# EAGLE schematic ECU (1) (EAGLE 6.5.0)

## Sheet 1 of 3
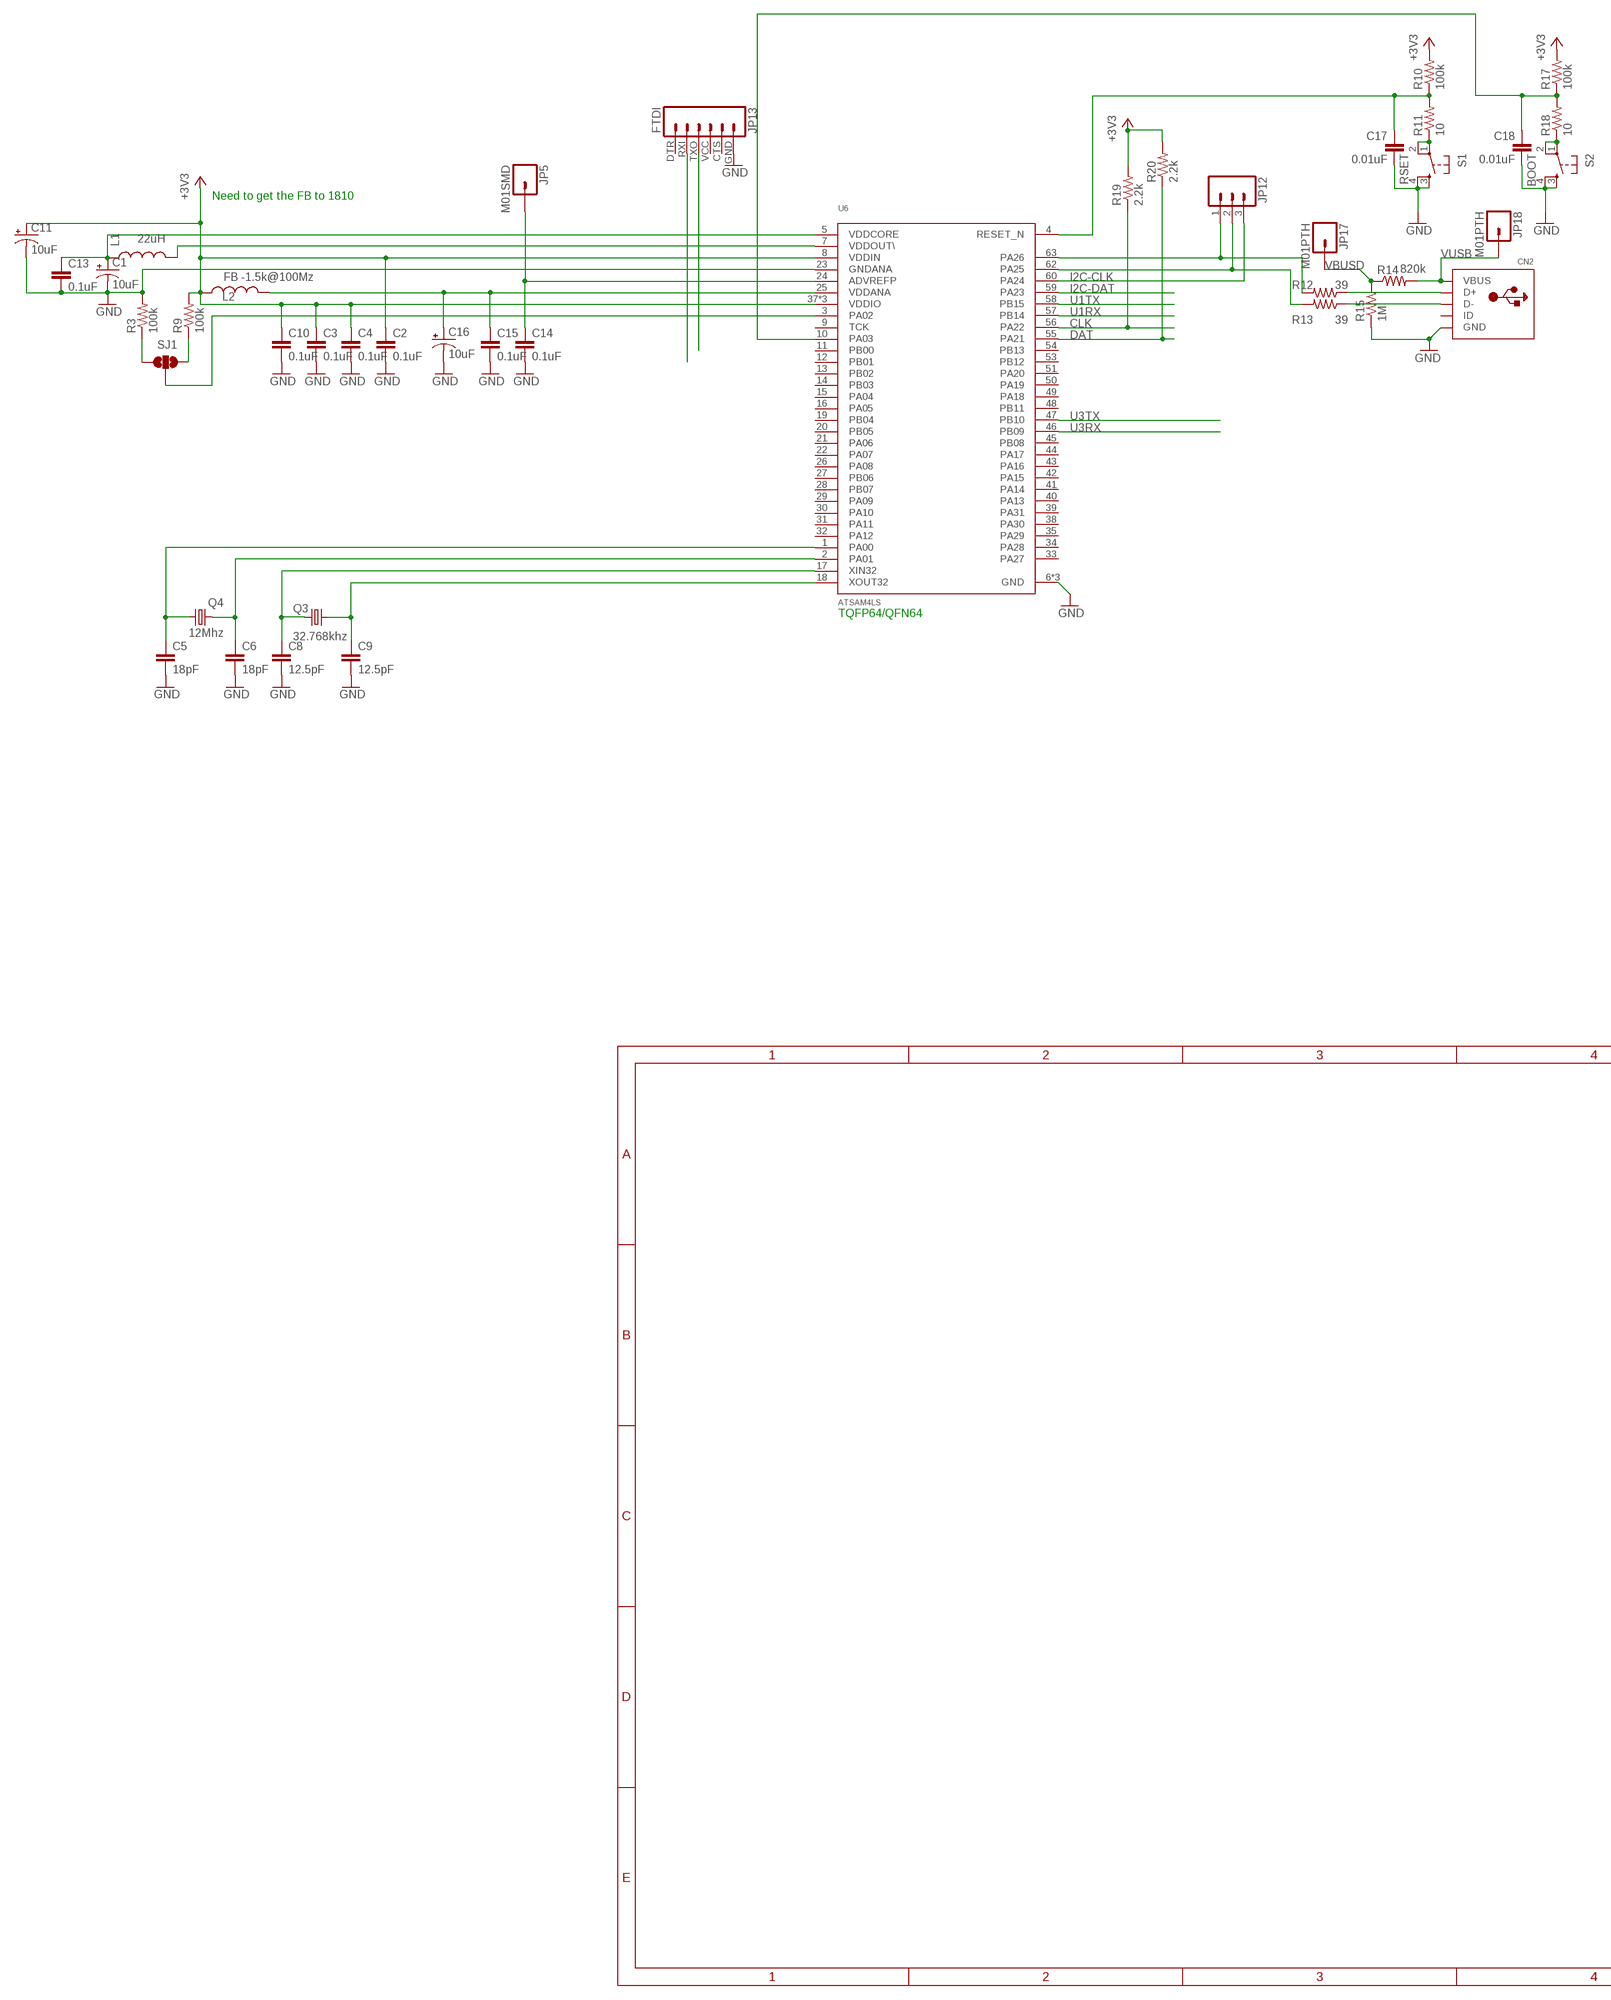
[diagram p0: schematic, sheet 1, part 1 of 2]
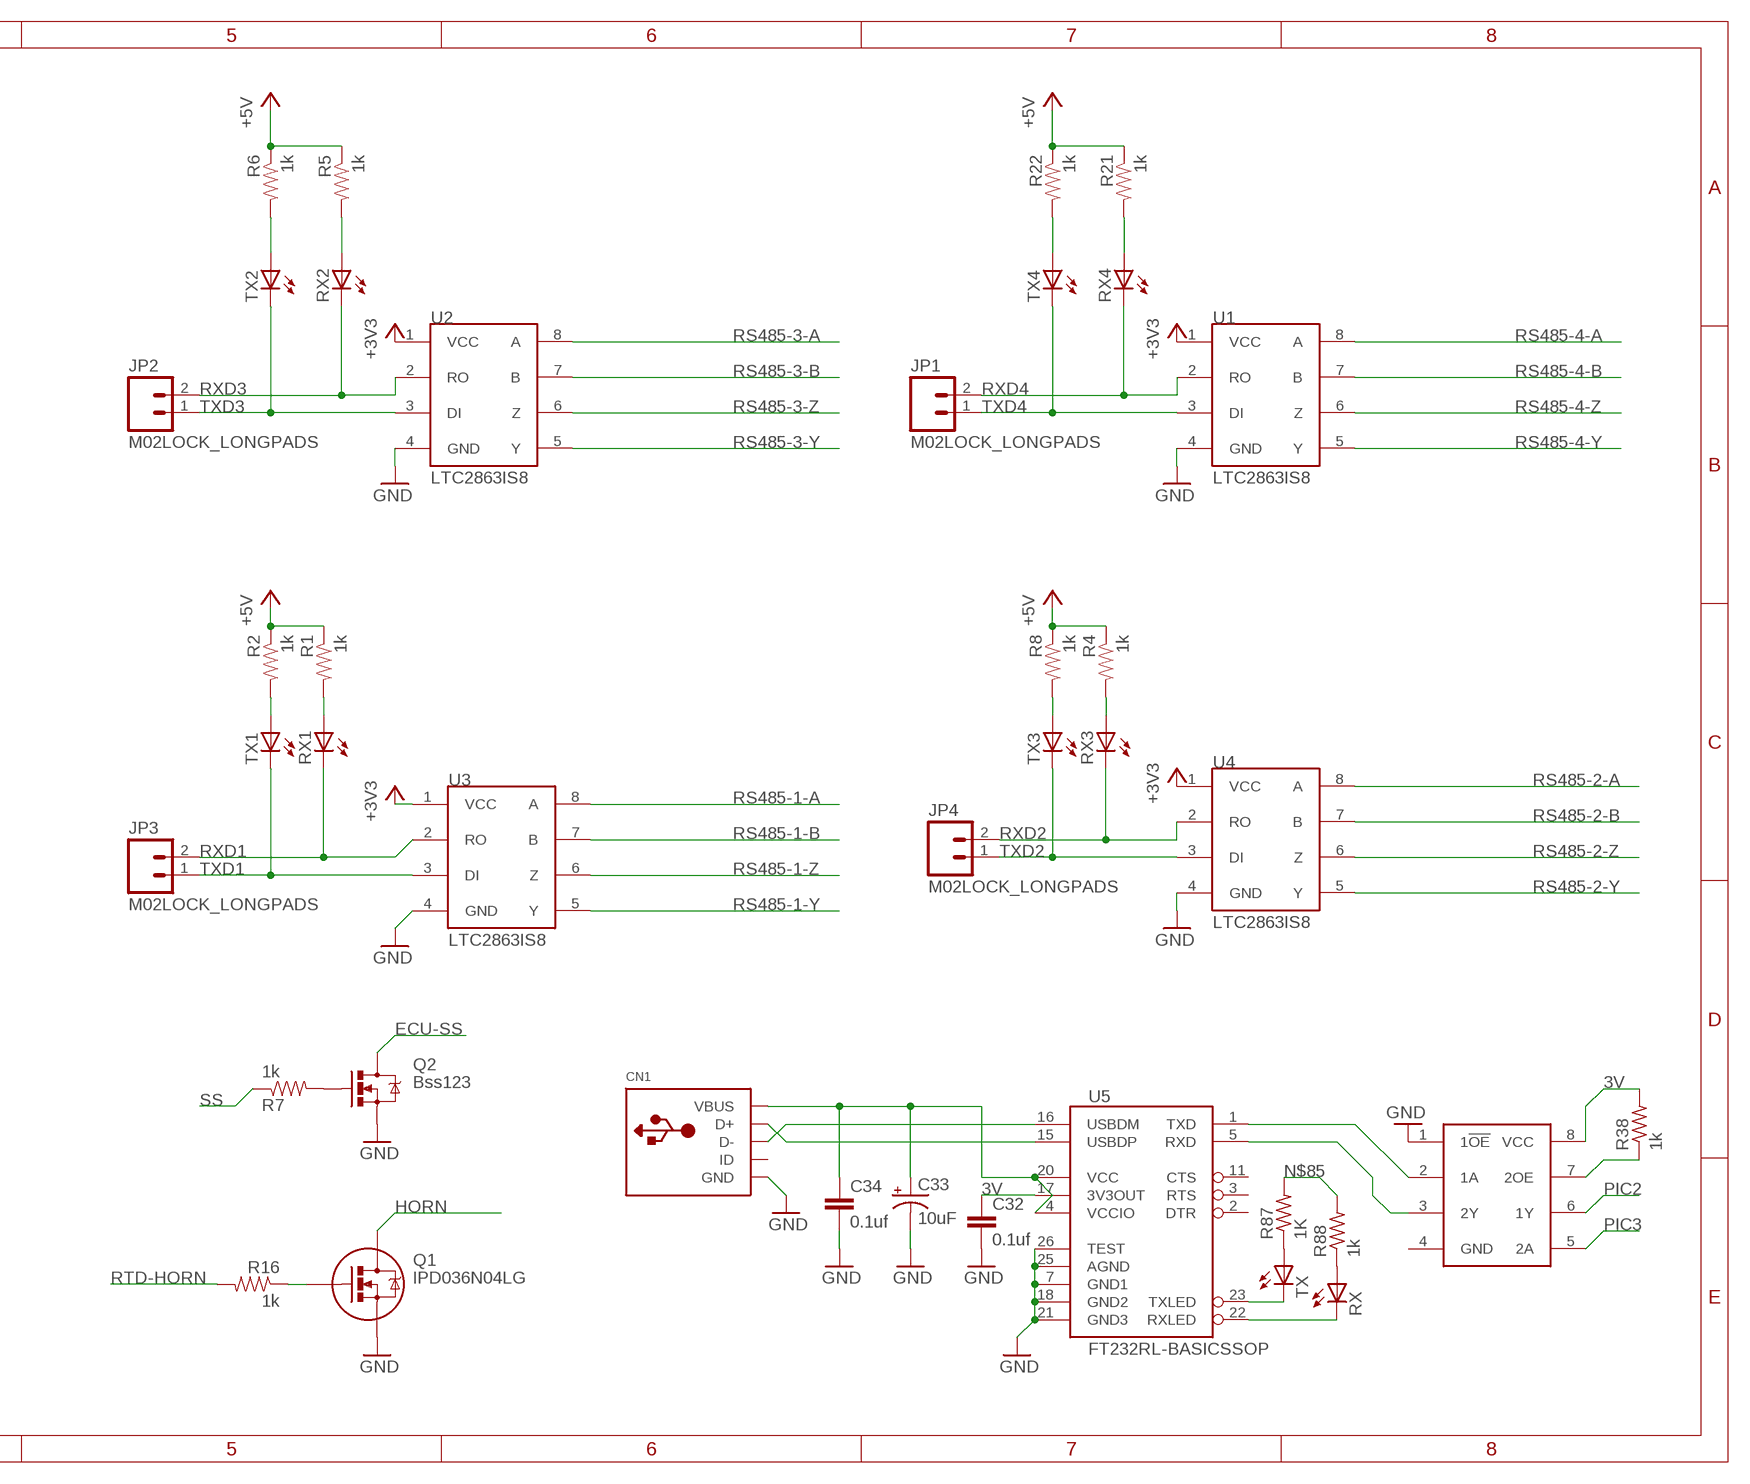
[diagram p1: schematic, sheet 1, part 2 of 2]

### Parts
C1  10uF  CAP_POL1206  [EIA3216]
C2  0.1uF  CAP0805  [0805]
C3  0.1uF  CAP0805  [0805]
C4  0.1uF  CAP0805  [0805]
C5  18pF  CAP0805  [0805]
C6  18pF  CAP0805  [0805]
C8  12.5pF  CAP0805  [0805]
C9  12.5pF  CAP0805  [0805]
C10  0.1uF  CAP0805  [0805]
C11  10uF  10UF-16V-10%(TANT)  [EIA3216]
C13  0.1uF  CAP0805  [0805]
C14  0.1uF  CAP0805  [0805]
C15  0.1uF  CAP0805  [0805]
C16  10uF  CAP_POL1206  [EIA3216]
C17  0.01uF  CAP0805  [0805]
C18  0.01uF  CAP0805  [0805]
C32  0.1uf  CAP0805  [0805]
C33  10uF  CAP_POL1206  [EIA3216]
C34  0.1uf  CAP0805  [0805]
CN1  USBMOLEX  [USB-MINIB-THM-MOLEX]
CN2  USBMOLEX  [USB-MINIB-THM-MOLEX]
JP1  M02LOCK_LONGPADS  [1X02_LOCK_LONGPADS]
JP2  M02LOCK_LONGPADS  [1X02_LOCK_LONGPADS]
JP3  M02LOCK_LONGPADS  [1X02_LOCK_LONGPADS]
JP4  M02LOCK_LONGPADS  [1X02_LOCK_LONGPADS]
JP5  M01SMD  [LUXEON-PAD]
JP12  M03LOCK  [1X03_LOCK]
JP13  FTDI  FTDI_BASICPTH  [FTDI_BASIC]
JP17  M01PTH  [1X01]
JP18  M01PTH  [1X01]
L1  22uH  INDUCTOR0805  [0805]
L2  FB -1.5k@100Mz  INDUCTOR0805  [0805]
Q1  IPD036N04LG  [TO-252]
Q2  Bss123  MOSFET-NCHANNELBSS123LT1G  [SOT23]
Q3  32.768khz  CRYSTALMM20SS  [MM20SS]
Q4  12Mhz  CRYSTALCTS406  [CTS406]
R1  1k  RESISTOR0805-RES  [0805]
R2  1k  RESISTOR0805-RES  [0805]
R3  100k  RESISTOR0805-RES  [0805]
R4  1k  RESISTOR0805-RES  [0805]
R5  1k  RESISTOR0805-RES  [0805]
R6  1k  RESISTOR0805-RES  [0805]
R7  1k  RESISTOR0805-RES  [0805]
R8  1k  RESISTOR0805-RES  [0805]
R9  100k  RESISTOR0805-RES  [0805]
R10  100k  RESISTOR0805-RES  [0805]
R11  10  RESISTOR0805-RES  [0805]
R12  39  RESISTOR0805-RES  [0805]
R13  39  RESISTOR0805-RES  [0805]
R14  820k  RESISTOR0805-RES  [0805]
R15  1M  RESISTOR0805-RES  [0805]
R16  1k  RESISTOR0805-RES  [0805]
R17  100k  RESISTOR0805-RES  [0805]
R18  10  RESISTOR0805-RES  [0805]
R19  2.2k  RESISTOR0805-RES  [0805]
R20  2.2k  RESISTOR0805-RES  [0805]
R21  1k  RESISTOR0805-RES  [0805]
R22  1k  RESISTOR0805-RES  [0805]
R38  1k  R-US_R0805  [R0805]
R87  1K  R-US_R0805  [R0805]
R88  1k  R-US_R0805  [R0805]
RX  LEDCHIPLED_0805  [CHIPLED_0805]
RX1  LEDCHIP-LED0805  [CHIP-LED0805]
RX2  LEDCHIP-LED0805  [CHIP-LED0805]
RX3  LEDCHIP-LED0805  [CHIP-LED0805]
RX4  LEDCHIP-LED0805  [CHIP-LED0805]
S1  RSET  TAC_SWITCHPTH  [TACTILE-PTH]
S2  BOOT  TAC_SWITCHPTH  [TACTILE-PTH]
SJ1  SOLDERJUMPER_2WAYS  [SJ_3]
TX  LEDCHIPLED_0805  [CHIPLED_0805]
TX1  LEDCHIP-LED0805  [CHIP-LED0805]
TX2  LEDCHIP-LED0805  [CHIP-LED0805]
TX3  LEDCHIP-LED0805  [CHIP-LED0805]
TX4  LEDCHIP-LED0805  [CHIP-LED0805]
U1  LTC2863IS8  ISL83077  [SO08]
U2  LTC2863IS8  ISL83077  [SO08]
U3  LTC2863IS8  ISL83077  [SO08]
U4  LTC2863IS8  ISL83077  [SO08]
U5  FT232RL-BASICSSOP  [SSOP28DB]
U6  ATSAM4LS  SAM4L  [TQFP-64]
U14  SN74LVC2G241DCTR  [VFSOP-8]

### Nets
3V: C32.1 R38.2 U5.17(3V3OUT) U14.8(VCC)
+3V3: C2.1 C3.1 C4.1 C10.1 C11.A(+) L2.1 R9.2 R10.2 R17.2 R19.2 R20.2 U1.1(VCC) U2.1(VCC) U3.1(VCC) U4.1(VCC) U6.8(VDDIN) U6.37(VDDIO) U6.52(VDDIO) U6.61(VDDIO) ; also sheet 2
+5V: R1.1 R2.1 R4.1 R5.1 R6.1 R8.1 R21.1 R22.1
CLK: R19.1 U6.56(PA22)
DAT: R20.1 U6.55(PA21)
ECU-SS: Q2.3(D)
GND: C1.C(-) C2.2 C3.2 C4.2 C5.2 C6.2 C8.2 C9.2 C10.2 C11.C(-) C13.2 C14.2 C15.2 C16.C(-) C17.2 C18.2 C32.2 C33.C(-) C34.2 CN1.GND CN2.GND JP13.GND Q1.3(S) Q2.2(S) R3.2 R15.1 S1.3 S1.4 S2.3 S2.4 U1.4(GND) U2.4(GND) U3.4(GND) U4.4(GND) U5.7(GND1) U5.18(GND2) U5.21(GND3) U5.25(AGND) U5.26(TEST) U6.6(GND) U6.23(GNDANA) U6.36(GND) U6.64(GND) U14.1(1!OE) ; also sheet 2,3
HORN: Q1.2(D)
I2C-CLK: JP12.3 U6.60(PA24)
I2C-DAT: U6.59(PA23)
N$1: Q1.1(G) R16.1
N$2: R11.1 S1.1 S1.2
N$3: L1.2 U6.7(VDDOUT\)
N$4: R38.1 U14.7(2OE)
N$5: C1.A(+) C13.1 L1.1 U6.5(VDDCORE)
N$6: C8.1 Q3.1 U6.17(XIN32)
N$7: R1.2 RX1.A
N$8: R2.2 TX1.A
N$9: C9.1 Q3.4 U6.18(XOUT32)
N$10: C6.1 Q4.1 U6.2(PA01)
N$11: C5.1 Q4.3 U6.1(PA00)
N$12: R4.2 RX3.A
N$13: R8.2 TX3.A
N$14: R3.1 SJ1.3
N$15: R9.1 SJ1.1
N$16: C15.1 C16.A(+) L2.2 U6.25(VDDANA)
N$17: R5.2 RX2.A
N$18: R6.2 TX2.A
N$19: SJ1.2 U6.3(PA02)
N$20: C14.1 JP5.P$1 U6.24(ADVREFP)
N$21: C17.1 R10.1 R11.2 U6.4(RESET_N)
N$22: CN2.D+ R12.1
N$24: R21.2 RX4.A
N$25: CN2.D- R13.1
N$26: R18.1 S2.1 S2.2
N$27: C18.1 R17.1 R18.2 U6.10(PA03)
N$28: Q2.1(G) R7.2
N$29: JP12.1 R12.2 U6.63(PA26)
N$30: JP12.2 R13.2 U6.62(PA25)
N$44: R22.2 TX4.A
N$78: CN1.D- U5.16(USBDM)
N$79: CN1.D+ U5.15(USBDP)
N$81: R87.1 TX.A
N$82: R88.1 RX.A
N$83: TX.C U5.23(TXLED)
N$84: RX.C U5.22(RXLED)
N$85: C33.A(+) C34.1 CN1.VBUS R87.2 R88.2 U5.4(VCCIO) U5.20(VCC)
N$93: U5.1(TXD) U14.2(1A)
N$94: U5.5(RXD) U14.3(2Y)
PIC2: U14.6(1Y)
PIC3: U14.5(2A)
RS485-1-A: U3.8(A) ; also sheet 3
RS485-1-B: U3.7(B) ; also sheet 3
RS485-1-Y: U3.5(Y) ; also sheet 3
RS485-1-Z: U3.6(Z) ; also sheet 3
RS485-2-A: U4.8(A) ; also sheet 3
RS485-2-B: U4.7(B) ; also sheet 3
RS485-2-Y: U4.5(Y) ; also sheet 3
RS485-2-Z: U4.6(Z) ; also sheet 3
RS485-3-A: U2.8(A) ; also sheet 3
RS485-3-B: U2.7(B) ; also sheet 3
RS485-3-Y: U2.5(Y) ; also sheet 3
RS485-3-Z: U2.6(Z) ; also sheet 3
RS485-4-A: U1.8(A) ; also sheet 3
RS485-4-B: U1.7(B) ; also sheet 3
RS485-4-Y: U1.5(Y) ; also sheet 3
RS485-4-Z: U1.6(Z) ; also sheet 3
RTD-HORN: R16.2
RXD1: JP3.2 RX1.C U3.2(RO)
RXD2: JP4.2 RX3.C U4.2(RO)
RXD3: JP2.2 RX2.C U2.2(RO)
RXD4: JP1.2 RX4.C U1.2(RO)
SS: R7.1
TXD1: JP3.1 TX1.C U3.3(DI)
TXD2: JP4.1 TX3.C U4.3(DI)
TXD3: JP2.1 TX2.C U2.3(DI)
TXD4: JP1.1 TX4.C U1.3(DI)
U0RX: JP13.TXO
U0TX: JP13.RXI
U1RX: U6.57(PB14)
U1TX: U6.58(PB15)
U3RX: U6.46(PB09)
U3TX: U6.47(PB10)
VBUSD: JP17.1 R14.1 R15.2
VUSB: CN2.VBUS JP18.1 R14.2
Unconnected: CN1.ID CN2.ID JP13.CTS JP13.DTR JP13.VCC U5.2(DTR) U5.3(RTS) U5.11(CTS) U6.9(TCK) U6.11(PB00) U6.12(PB01) U6.13(PB02) U6.14(PB03) U6.15(PA04) U6.16(PA05) U6.19(PB04) U6.20(PB05) U6.21(PA06) U6.22(PA07) U6.26(PA08) U6.27(PB06) U6.28(PB07) U6.29(PA09) U6.30(PA10) U6.31(PA11) U6.32(PA12) U6.33(PA27) U6.34(PA28) U6.35(PA29) U6.38(PA30) U6.39(PA31) U6.40(PA13) U6.41(PA14) U6.42(PA15) U6.43(PA16) U6.44(PA17) U6.45(PB08) U6.48(PB11) U6.49(PA18) U6.50(PA19) U6.51(PA20) U6.53(PB12) U6.54(PB13) U14.4(GND)

### Notes on the sheet
- Need to get the FB to 1810
- TQFP64/QFN64

## Sheet 2 of 3
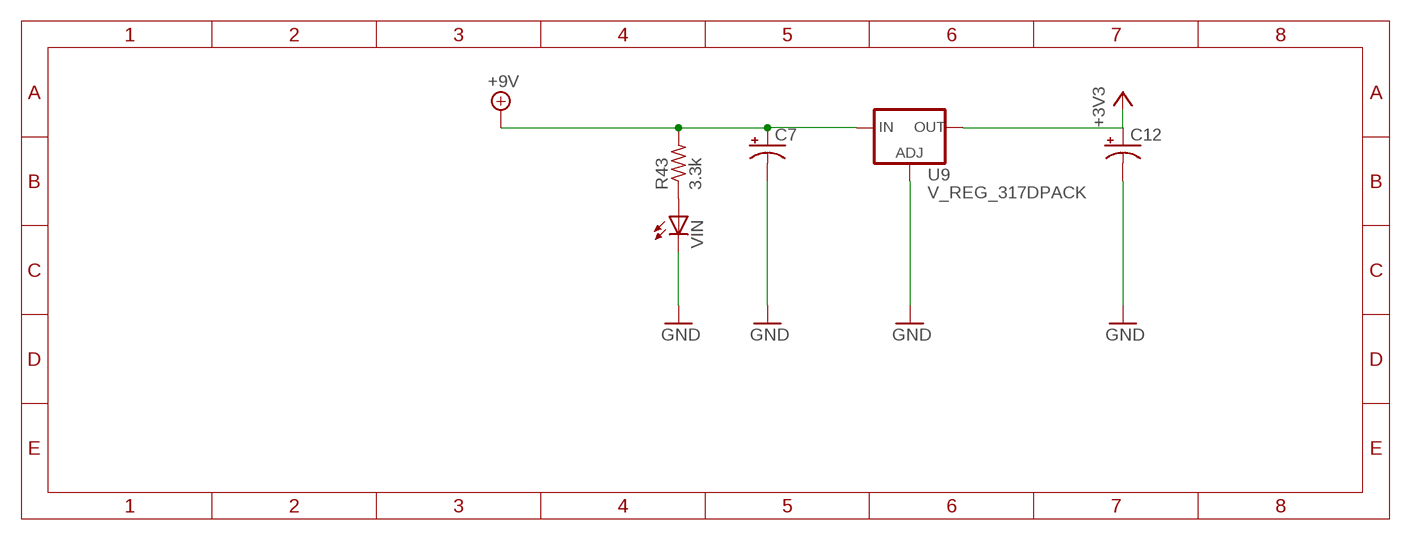
[diagram p2: schematic, sheet 2]

### Parts
C7  CAP_POL7343  [EIA7343]
C12  CAP_POL3528  [EIA3528]
R43  3.3k  R-US_R0805  [R0805]
U9  V_REG_317DPACK  [V-REG_DPACK]
VIN  LEDCHIP-LED0805  [CHIP-LED0805]

### Nets
+3V3: C12.A(+) U9.4(OUT) ; also sheet 1
+9V: C7.A(+) R43.2 U9.3(IN) ; also sheet 3
GND: C7.C(-) C12.C(-) U9.1(ADJ) VIN.C ; also sheet 1,3
N$33: R43.1 VIN.A

## Sheet 3 of 3
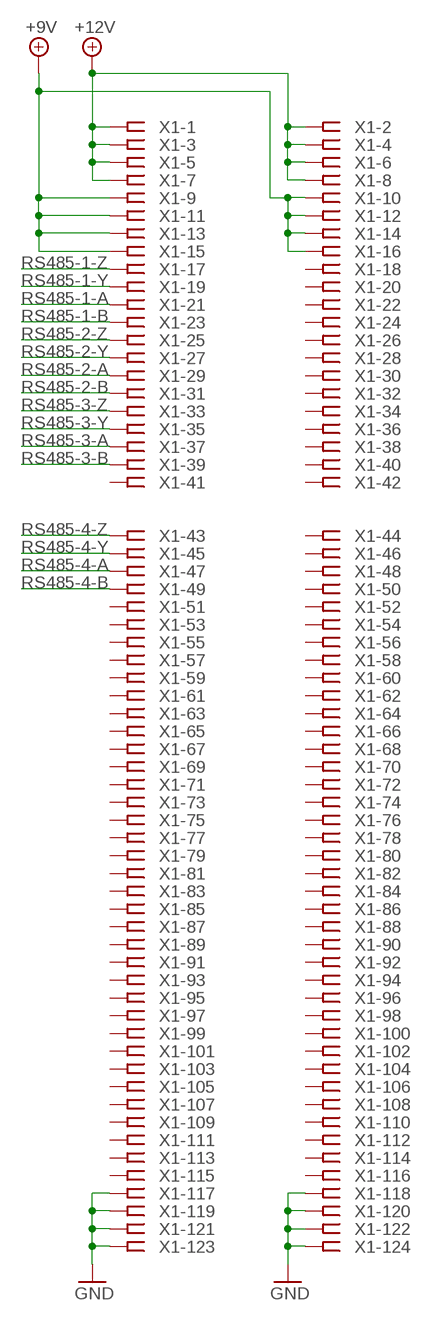
[diagram p3: schematic, sheet 3]

### Parts
X1  AGP-3X3  [AGP-3X3]

### Nets
+9V: X1.9 X1.10 X1.11 X1.12 X1.13 X1.14 X1.15 X1.16 ; also sheet 2
+12V: X1.1 X1.2 X1.3 X1.4 X1.5 X1.6 X1.7 X1.8
GND: X1.117 X1.118 X1.119 X1.120 X1.121 X1.122 X1.123 X1.124 ; also sheet 1,2
RS485-1-A: X1.21 ; also sheet 1
RS485-1-B: X1.23 ; also sheet 1
RS485-1-Y: X1.19 ; also sheet 1
RS485-1-Z: X1.17 ; also sheet 1
RS485-2-A: X1.29 ; also sheet 1
RS485-2-B: X1.31 ; also sheet 1
RS485-2-Y: X1.27 ; also sheet 1
RS485-2-Z: X1.25 ; also sheet 1
RS485-3-A: X1.37 ; also sheet 1
RS485-3-B: X1.39 ; also sheet 1
RS485-3-Y: X1.35 ; also sheet 1
RS485-3-Z: X1.33 ; also sheet 1
RS485-4-A: X1.47 ; also sheet 1
RS485-4-B: X1.49 ; also sheet 1
RS485-4-Y: X1.45 ; also sheet 1
RS485-4-Z: X1.43 ; also sheet 1
Unconnected: X1.18 X1.20 X1.22 X1.24 X1.26 X1.28 X1.30 X1.32 X1.34 X1.36 X1.38 X1.40 X1.41 X1.42 X1.44 X1.46 X1.48 X1.50 X1.51 X1.52 X1.53 X1.54 X1.55 X1.56 X1.57 X1.58 X1.59 X1.60 X1.61 X1.62 X1.63 X1.64 X1.65 X1.66 X1.67 X1.68 X1.69 X1.70 X1.71 X1.72 X1.73 X1.74 X1.75 X1.76 X1.77 X1.78 X1.79 X1.80 X1.81 X1.82 X1.83 X1.84 X1.85 X1.86 X1.87 X1.88 X1.89 X1.90 X1.91 X1.92 X1.93 X1.94 X1.95 X1.96 X1.97 X1.98 X1.99 X1.100 X1.101 X1.102 X1.103 X1.104 X1.105 X1.106 X1.107 X1.108 X1.109 X1.110 X1.111 X1.112 X1.113 X1.114 X1.115 X1.116

## Library data of the parts
C1 C16 = SparkFun-Passives:CAP_POL: Capacitor Polarized These are standard SMD and PTH capacitors. Normally 10uF, 47uF, and 100uF in electrolytic and tantalum varieties. Always verify the external diameter of the through hole cap, it varies with capacity, voltage, and manufacturer. The EIA devices should be standard.
C2-C6 C8-C10 C13-C15 C17 C18 = SparkFun-Passives:CAP: Capacitor Standard 0603 ceramic capacitor, and 0.1" leaded capacitor.
C7 C12 = SparkFun-Capacitors:CAP_POL: Capacitor Polarized These are standard SMD and PTH capacitors. Normally 10uF, 47uF, and 100uF in electrolytic and tantalum varieties. Always verify the external diameter of the through hole cap, it varies with capacity, voltage, and manufacturer. The EIA devices should be standard.
C11 = SparkFun-Capacitors:10UF-16V-10%(TANT): CAP-00811 1206/EIA-3216 Tantalum capacitor; PROD_ID: CAP-00811
C32 C34 = SparkFun:CAP: Capacitor Standard 0603 ceramic capacitor, and 0.1" leaded capacitor.
C33 = SparkFun:CAP_POL: Capacitor Polarized These are standard SMD and PTH capacitors. Normally 10uF, 47uF, and 100uF in electrolytic and tantalum varieties. Always verify the external diameter of the through hole cap, it varies with capacity, voltage, and manufacturer. The EIA devices should be standard.
CN1 CN2 = adafruit:USB: USB Connectors USBMINIB - Surface Mount Female Mini-B USB Connector 4UConnector: 06564 By microbuilder.eu Thru-hole RA Female Mini-B USB Connector 4UConnector: 18732 By ladyada.net
JP1-JP4 = SparkFun-Connectors:M02: Standard 2-pin 0.1" header. Use with - straight break away headers ( PRT-00116) - right angle break away headers (PRT-00553) - swiss pins (PRT-00743) - machine pins (PRT-00117) - female headers (PRT-00115) Molex polarized connector foot print use with: PRT-08233 with associated crimp pins and housings. 2.54_SCREWTERM for use with PRT-10571. 3.5mm Screw Terminal footprints for PRT-08084 5mm Screw Terminal footprints for use with PRT-08433
JP5 JP17 JP18 = SparkFun-Connectors:M01: Header 1 Standard 1-pin 0.1" header. Use with straight break away headers (SKU : PRT-00116), right angle break away headers (PRT-00553), swiss pins (PRT-00743), machine pins (PRT-00117), and female headers (PRT-00115).
JP12 = SparkFun-Connectors:M03: Header 3 Standard 3-pin 0.1" header. Use with straight break away headers (SKU : PRT-00116), right angle break away headers (PRT-00553), swiss pins (PRT-00743), machine pins (PRT-00117), and female headers (PRT-00115). Molex polarized connector foot print use with SKU : PRT-08232 with associated crimp pins and housings.
JP13 = SparkFun-Connectors:FTDI_BASIC: FTDI Basic header with labels
L1 L2 = SparkFun-Passives:INDUCTOR: Inductors Basic Inductor/Choke - 0603 and 1206. Footprints are not proven and vary greatly between part numbers. SRN6045- 33uH, 20% 1.4A
Q1 = NASA_LIB:IPD036N04LG
Q2 = SparkFun-DiscreteSemi:MOSFET-NCHANNEL: Common NMOSFET Parts MFG P/N Store ID Prod ID FDD8780 TRANS-09984 SI7820DN TRANS-11055 FDS6630A IC-08089 2N7002PW TRANS-11151 FQP30N06L COM-10213 TRANS-10060 BSS123LT1G TRANS-08345 BSS138 TRANS-00830 BS170 2N7000; PROD_ID: TRANS-08345
Q3 Q4 = adafruit:CRYSTAL: CRYSTAL; OC_FARNELL: unknown; OC_NEWARK: unknown
R1-R22 = SparkFun-Passives:RESISTOR: Resistor Basic schematic elements and footprints for 0603, 1206, and PTH resistors.
R38 R43 R87 R88 = adafruit:R-US_: RESISTOR, American symbol
RX RX1-RX4 TX TX1-TX4 VIN = adafruit:LED: LED OSRAM: - CHIPLED LG R971, LG N971, LY N971, LG Q971, LY Q971, LO R971, LY R971 LH N974, LH R974 LS Q976, LO Q976, LY Q976 LO Q996 - Hyper CHIPLED LW Q18S LB Q993, LB Q99A, LB R99A - SideLED LS A670, LO A670, LY A670, LG A670, LP A670 LB A673, LV A673, LT A673, LW A673 LH A674 LY A675 LS A676, LA A676, LO A676, LY A676, LW A676 LS A679, LY A679, LG A679 - Hyper Micro SIDELED® LS Y876, LA Y876, LO Y876, LY Y876 LT Y87S - SmartLED LW L88C, LW L88S LB L89C, LB L89S, LG L890 LS L89K, LO L89K, LY L89K LS L896, LA L896, LO L896, LY L896 - TOPLED LS T670, LO T670, LY T670, LG T670, LP T670 LSG T670, LSP T670, LSY T670, LOP T670, LYG T670 LG T671, LOG T671, LSG T671 LB T673, LV T673, LT T673, LW T673 LH T674 LS T676, LA T676, LO T676, LY T676, LB T676, LH T676, LSB T676, LW T676 LB T67C, LV T67C, LT T67C, LS T67K, LO T67K, LY T67K, LW E67C LS E67B, LA E67B, LO E67B, LY E67B, LB E67C, LV E67C, LT E67C LW T67C LS T679, LY T679, LG T679 LS T770, LO T770, LY T770, LG T770, LP T770 LB T773, LV T773, LT T773, LW T773 LH T774 LS E675, LA E675, LY E675, LS T675 LS T776, LA T776, LO T776, LY T776, LB T776 LHGB T686 LT T68C, LB T68C - Hyper Mini TOPLED® LB M676 - Mini TOPLED Santana® LG M470 LS M47K, LO M47K, LY M47K Source: http://www.osram.convergy.de/
S1 S2 = SparkFun-Electromechanical:TAC_SWITCH: Momentary Switch Button commonly used for reset or general input. Spark Fun Electronics SKU : COM-00097 SMT- SWCH-08247
SJ1 = SparkFun-Passives:SOLDERJUMPER_2WAY: Solder Jumper 2 way solder jumper
U1-U4 = NASA_LIB:ISL83077
U5 = SparkFun:FT232RL-BASIC: USB UART This is the simplified version of the FT232RL unit. Only what you need, nothing you don't. Spark Fun Electronics SKU : COM-00650
U6 = DFT2:SAM4L
U9 = SparkFun-PowerIC:V_REG_317: Voltage Regulator Standard LM317 adjustable voltage regulator. AOI (Adjust Output Input). Google 'LM317 Calculator' for easy to use app to get the two resistor values needed. 240/720 for 5V output. 240/390 for 3.3V output. Spark Fun Electronics SKU : COM-00527
U14 = Cleaverbrooks:SN74LVC2G241DCTR
X1 = con-pc:AGP-3X3